# EAGLE schematic hbrigde (EAGLE 6.1)
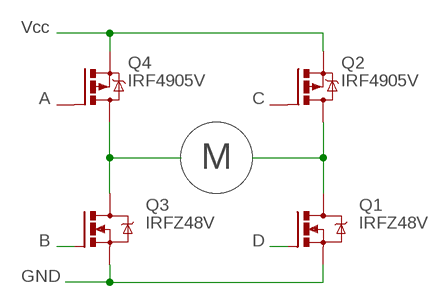
[diagram p0: schematic, sheet 1]

## Parts
Q1  IRFZ48V  [TO220BV]
Q2  IRF4905V  [TO220BV]
Q3  IRFZ48V  [TO220BV]
Q4  IRF4905V  [TO220BV]

## Nets
N$1: Q3.D Q4.D
N$2: Q1.D Q2.D
N$3: Q1.S Q3.S
N$4: Q2.S Q4.S
N$5: Q3.G
N$6: Q1.G
Unconnected: Q2.G Q4.G

## Notes on the sheet
- Vcc
- A | C
- M
- B | D
- GND

## Library data of the parts
Q1 Q3 = transistor-power:IRFZ48: N Channel HEXFET® Power MOSFET Logic Level Source: http://www.irf.com/product-info/datasheets/data/irfz48z.pdf
Q2 Q4 = transistor-power:IRF4905: P-Channel HEXFET® Power MOSFET RDS(on)= 0.02 Ohm, ID = -74A Source: http://www.irf.com/product-info/datasheets/data/irf4905pbf.pdf